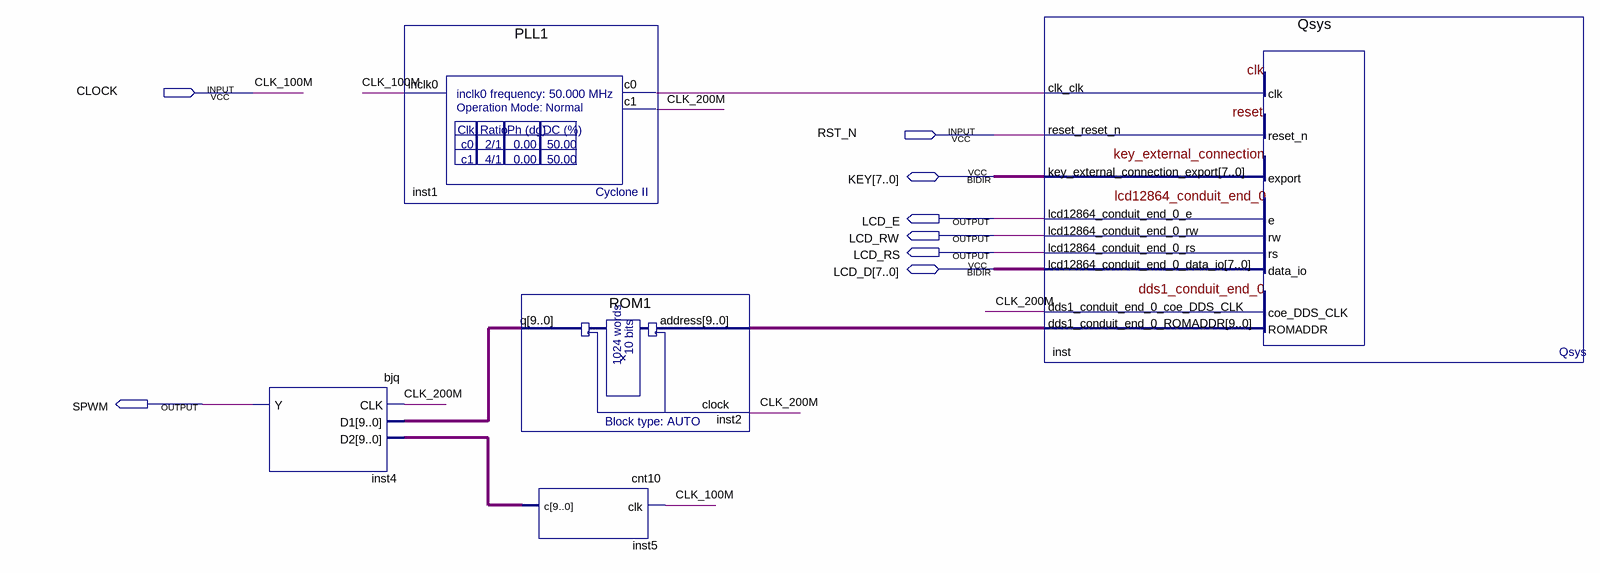
[diagram p0: schematic sheet]
// Quartus schematic Qsys_EP2C5.bdf as structural Verilog: 5 symbols, 8 pins
module Qsys_EP2C5 (
  input  CLOCK,
  input  RST_N,
  inout  [7:0] KEY,
  inout  [7:0] LCD_D,
  output LCD_E,
  output LCD_RW,
  output LCD_RS,
  output SPWM
);

  wire CLK_200M, inst1_c0;
  wire [9:0] inst2_q, inst5_c, inst_dds1_conduit_end_0_romaddr;

  bjq inst4 (.CLK(CLK_200M), .D1(inst2_q), .D2(inst5_c), .Y(SPWM));
  PLL1 inst1 (.inclk0(CLOCK), .c0(inst1_c0), .c1(CLK_200M));
  ROM1 inst2 (.address(inst_dds1_conduit_end_0_romaddr), .clock(CLK_200M), .q(inst2_q));
  cnt10 inst5 (.clk(CLOCK), .c(inst5_c));
  Qsys inst (
    .clk_clk(inst1_c0), .reset_reset_n(RST_N), .dds1_conduit_end_0_coe_DDS_CLK(CLK_200M),
    .lcd12864_conduit_end_0_e(LCD_E), .lcd12864_conduit_end_0_rw(LCD_RW), .lcd12864_conduit_end_0_rs(LCD_RS),
    .dds1_conduit_end_0_ROMADDR(inst_dds1_conduit_end_0_romaddr), .key_external_connection_export(KEY),
    .lcd12864_conduit_end_0_data_io(LCD_D));

  // Other names for the same wires on the sheet: CLK_100M = CLOCK
endmodule
